# Altium schematic sheet schematic.SchDoc
size A4; PageSetup: Record=PageOptions|CenterHorizontal=True|CenterVertical=True|PrintScale=1.00|XCorrection=1.00|YCorrection=1.00|PrintKind=0|BorderSize=5000000|LeftOffset=0|BottomOffset=0|Orientation=2|PaperLength=1000|PaperWidth=1000|Scale=100|PaperSource=7|PrintQuality=-3|MediaType=1|DitherType=10|PrintScaleMode=1|PaperKind=A4|PaperIndex=9
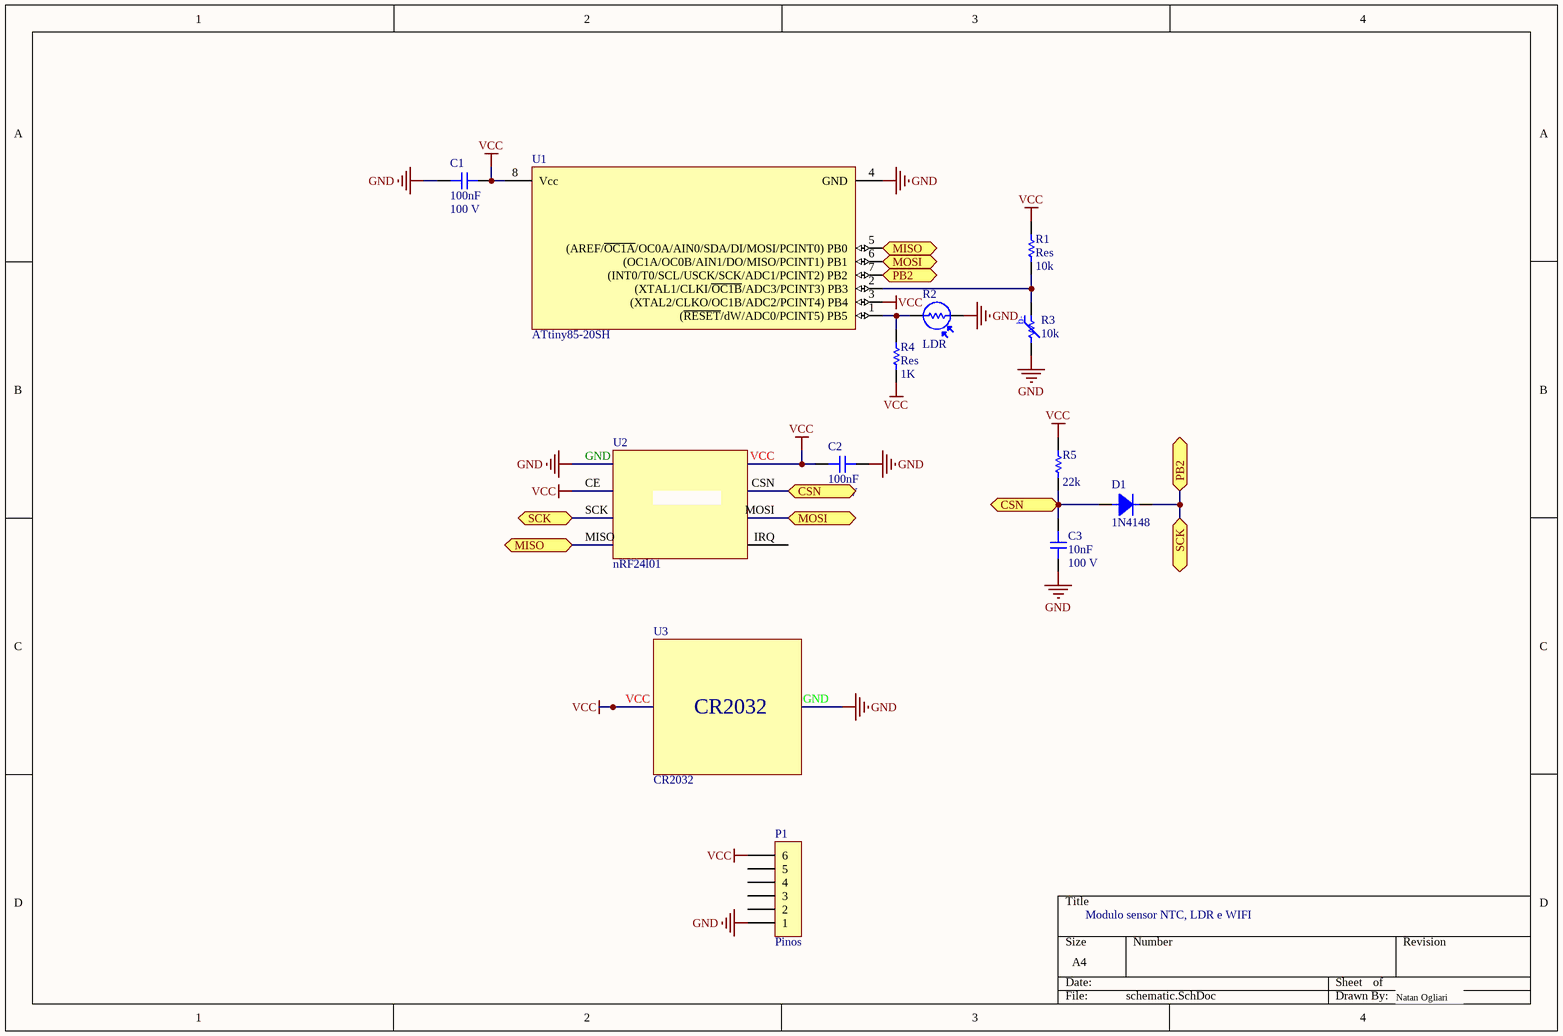
[diagram p0: schematic.SchDoc]

## Parts
C1  100nF  Voltage: 100 V  [0805C]
C2  100nF  Voltage: 100 V  [0805C]
C3  10nF  Voltage: 100 V  [0805C]
D1  1N4148  [425]
P1  Pinos  [HDR-M-1x6-2.54mm-180-9.2mm]
R1  Res  value 10k  [0805R]
R2  LDR  [LDR-5mm]
R3  10k  [Thermistor-100mil]
R4  Res  value 1K  [0805R]
R5  value 22k  [0805R]
U1  ATtiny85-20SH  [SOP08-5.3mm(1.27mm)]
U2  nRF24l01  [nRF24l01]
U3  CR2032  [CR2032]

## Ports
CSN, CSN (bidir), MISO, MOSI, MOSI (bidir), PB2, SCK, SCK (bidir)

## Nets
GND: C1.1 C2.2 C3.2 P1.1 R2.1 R3.2 U1.4(GND) U2.GND U3.GND
VCC: C1.2 C2.1 P1.6 R1.2 R4.1 R5.2 U1.3((XTAL2/CLKO/OC1B/ADC2/PCINT4)_PB4) U1.8(Vcc) U2.CE U2.VCC U3.VCC
CSN: C3.1 D1.A R5.1 U2.CSN ; port CSN
MISO: U1.5((AREF/~{OC1A}/OC0A/AIN0/SDA/DI/MOSI/PCINT0)_PB0) U2.MISO ; port MISO
MOSI: U1.6((OC1A/OC0B/AIN1/DO/MISO/PCINT1)_PB1) U2.MOSI ; port MOSI
PB2: D1.K U1.7((INT0/T0/SCL/USCK/SCK/ADC1/PCINT2)_PB2) U2.SCK ; port PB2, port SCK
NetR1_1: R1.1 R3.1 U1.2((XTAL1/CLKI/~{OC1B}/ADC3/PCINT3)_PB3)
NetR2_2: R2.2 R4.2 U1.1((~{RESET}/dW/ADC0/PCINT5)_PB5)

Not connected (* = marked no-connect by the designer): P1 2 3 4 5; U2 IRQ

## Notes on the sheet
- Modulo sensor NTC, LDR e WIFI
- Natan Ogliari
- (in symbol NTC) -q

## Library data of the parts
C1-C3 = Capacitor: Published: 8-Jun-2000; LatestRevisionDate: 17-Jul-2002; LatestRevisionNote: Re-released for DXP Platform.; PackageReference: RAD-0.3; Publisher: Altium Limited
D1 = 1N4148: Small Signal Diode; Peak Repetitive Reverse Voltage (Vrrm): 100 V; Forward Current (If): 300 mA; Non-Repetitive Peak Forward Surge Current (Ifsm): 1 A; Forward Voltage (Vf): 1 V; Reverse Current (Ir): 25 nA; Total Capacitance (Ct): 4 pF; Max Recovery Time (trr): 4ns
P1 = Header_1x6: Header, 1 Line, 6 Columns, 6 Pins; LatestRevisionDate: 17-Jul-2002; LatestRevisionNote: Re-released for DXP Platform.; Publisher: Altium Limited
R1 R4 R5 = Res1: Resistor; Published: 8-Jun-2000; LatestRevisionDate: 17-Jul-2002; LatestRevisionNote: Re-released for DXP Platform.; PackageReference: AXIAL-0.3; Publisher: Altium Limited; PackageDescription: Axial Device, Thru-Hole; 2 Leads; 0.3 in Pin Spacing
R2 = LDR: Ligh Dependant Resistor
R3 = NTC: Negative Temperature Coefficient Thermistor
U1 = ATtiny85-20SH: Atmel 8-bit AVR Microcontroller with 8 KB In-System Programmable Flash; ADC Channel: 4; Clock Frequency: 0 - 20 MHz; Debug: debugWire; EEPROM Memory: 512 B; Flash Memory: 8 KB; I/O Pins: 6; PWM Channel: 2; Serial USI: 1; Supply Voltage (Vdd): 2.7 - 5.5 V; Analog Comparator: *; SRAM Memory: 512 B; Timer 8 bits: 1